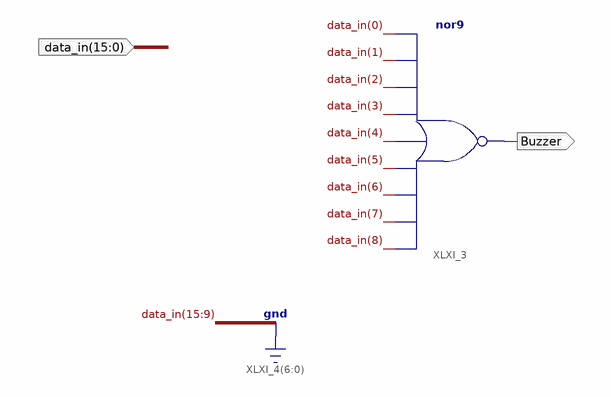
[diagram p0: schematic sheet 1]
// Xilinx ISE schematic comp16bits.sch (spartan6) as structural Verilog: 1 symbols, 2 ports
module comp16bits (
  input  [15:0] data_in,
  output Buzzer
);

  nor XLXI_3 (Buzzer, data_in[8], data_in[7], data_in[6], data_in[5], data_in[4], data_in[3], data_in[2], data_in[1], data_in[0]);
  // also tied to GND on the sheet: {data_in[9], data_in[10], data_in[11], data_in[12], data_in[13], data_in[14], data_in[15]}
endmodule
